# Altium schematic sheet Fri3d_2024_Exp0_Keyboard_01.SchDoc: Keyboard
size A3; Date: 18/06/2024; DrawnBy: Wim Van Gool; DocumentNumber: 2; Revision: 01; SheetNumber: 2; SheetTotal: 2
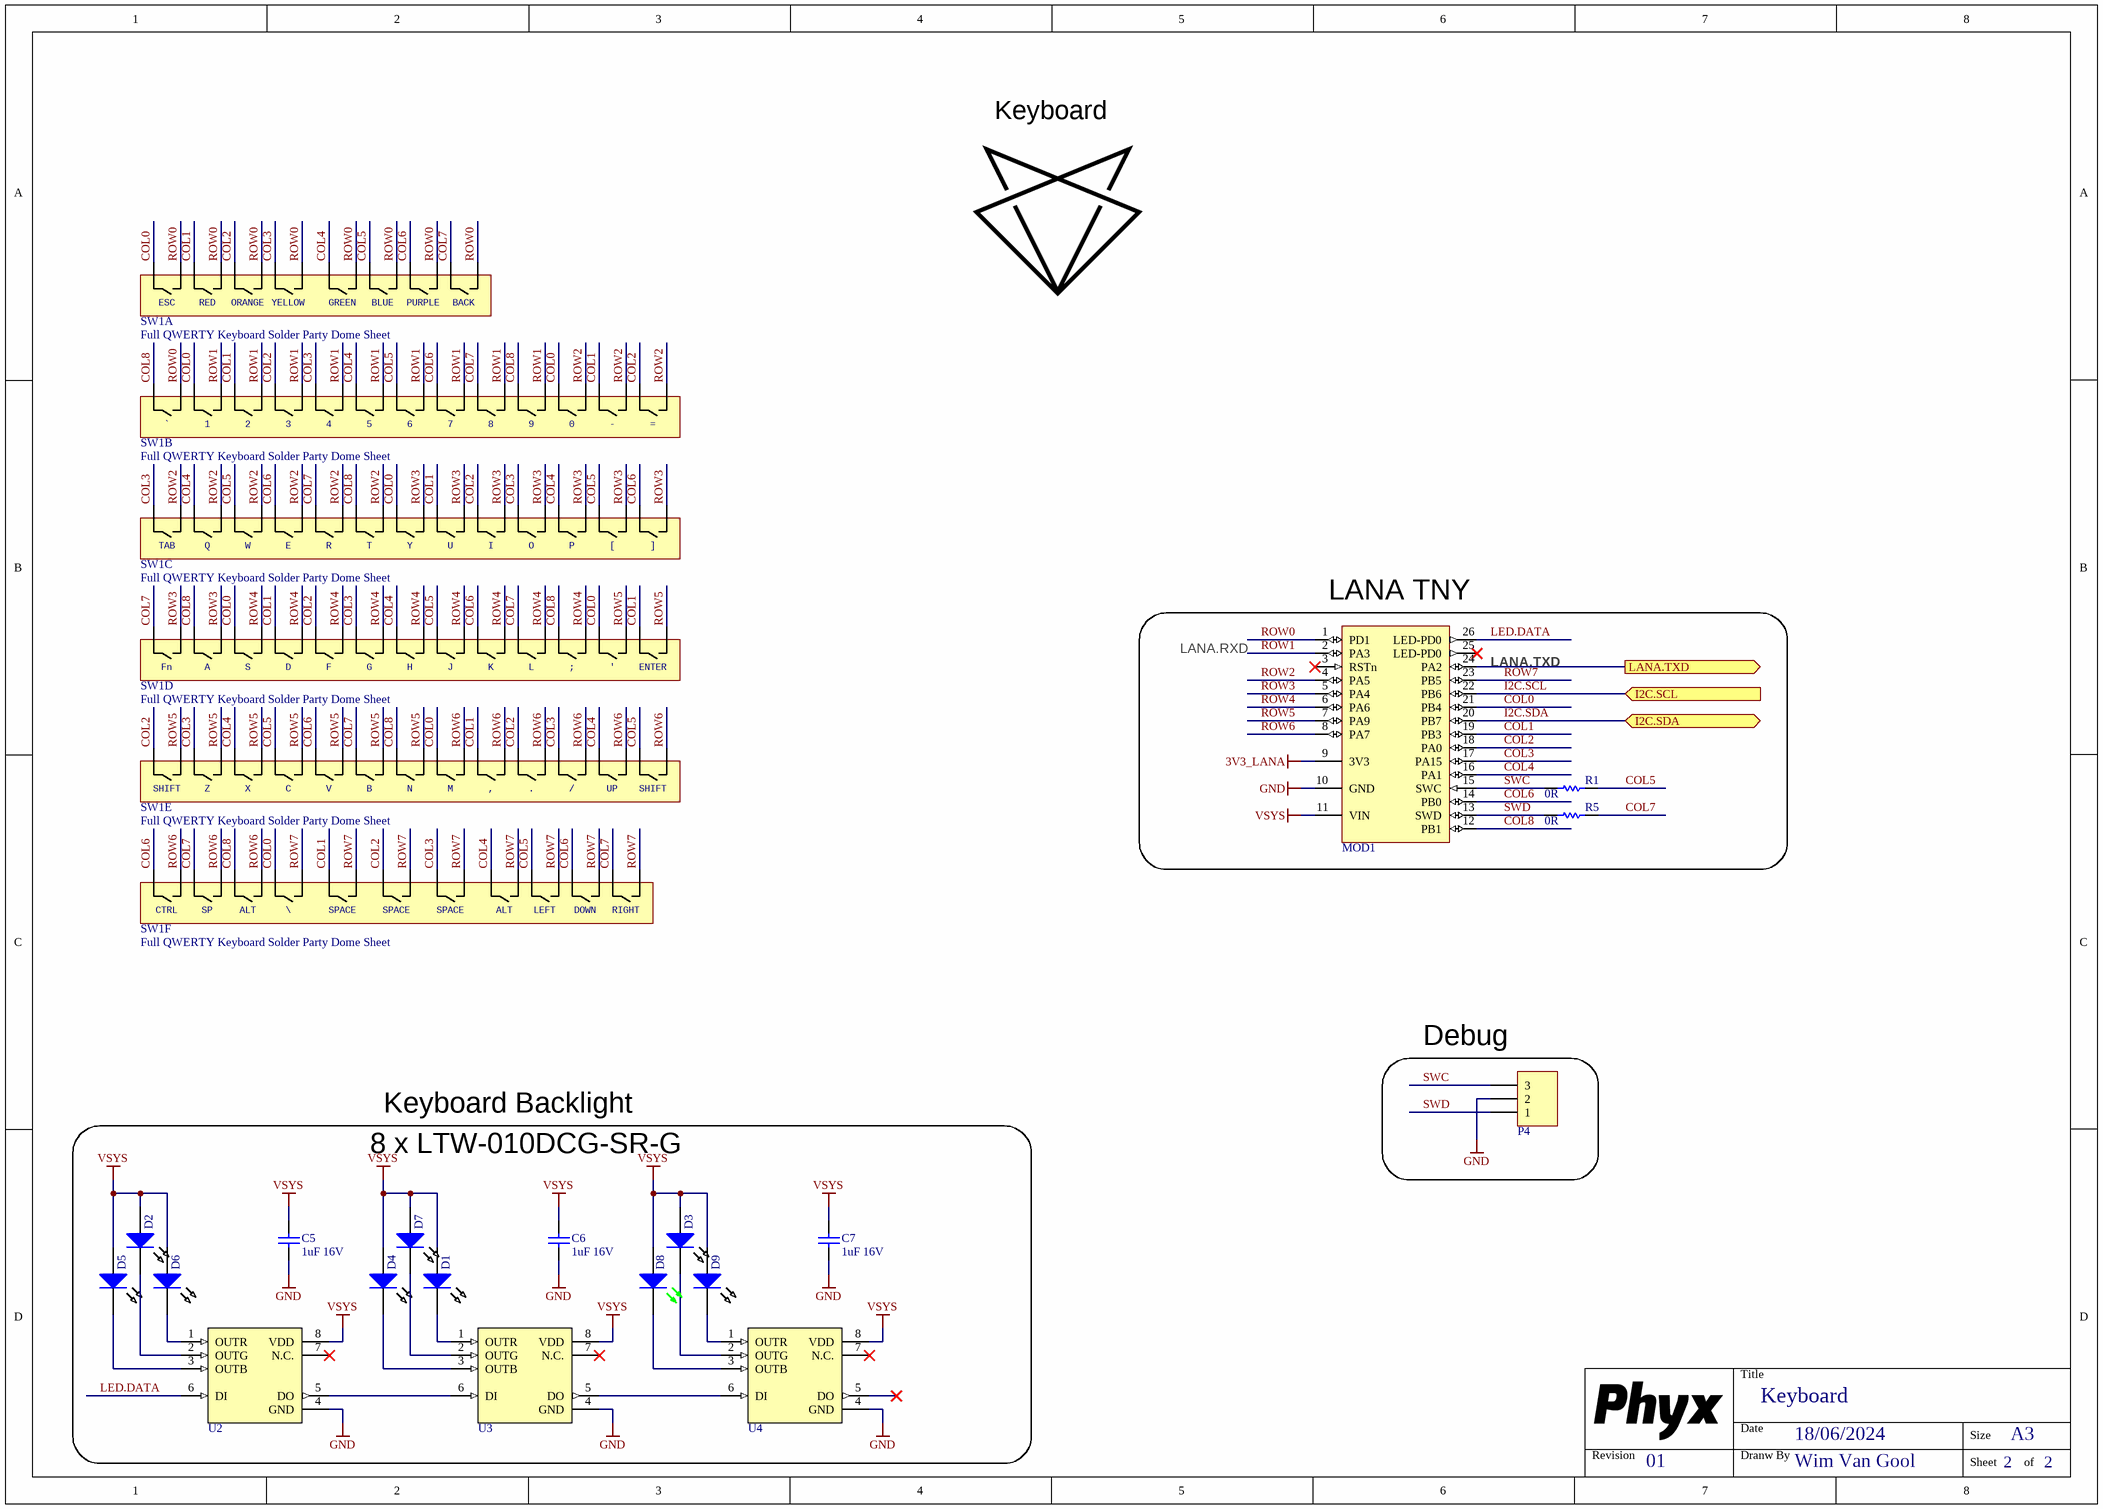
[diagram p0: Fri3d_2024_Exp0_Keyboard_01.SchDoc]

## Parts
C5  value 1uF 16V  [C0603_N]  (hidden comment: CAP_CERAMIC)
C6  value 1uF 16V  [C0603_N]  (hidden comment: CAP_CERAMIC)
C7  value 1uF 16V  [C0603_N]  (hidden comment: CAP_CERAMIC)
D1  Side emitting Cool White LED 3.0V 30mA 120° 2900mcd  [LITE_LTW-010DCG]  (value not drawn)
D2  Side emitting Cool White LED 3.0V 30mA 120° 2900mcd  [LITE_LTW-010DCG]  (value not drawn)
D3  Side emitting Cool White LED 3.0V 30mA 120° 2900mcd  [LITE_LTW-010DCG]  (value not drawn)
D4  Side emitting Cool White LED 3.0V 30mA 120° 2900mcd  [LITE_LTW-010DCG]  (value not drawn)
D5  Side emitting Cool White LED 3.0V 30mA 120° 2900mcd  [LITE_LTW-010DCG]  (value not drawn)
D6  Side emitting Cool White LED 3.0V 30mA 120° 2900mcd  [LITE_LTW-010DCG]  (value not drawn)
D7  Side emitting Cool White LED 3.0V 30mA 120° 2900mcd  [LITE_LTW-010DCG]  (value not drawn)
D8  Default 0805 Green LED  [LED_0805_GR]  (value not drawn)
D9  Side emitting Cool White LED 3.0V 30mA 120° 2900mcd  [LITE_LTW-010DCG]  (value not drawn)
MOD1  CH23V203 based TNY module  [PHYX_LANA_TNY_SMD]  (value not drawn)
P4  Header 3  [HDR1X3]  (value not drawn)
R1  value 0R  [R0603_N]  (hidden comment: RESISTOR)
R5  value 0R  [R0603_N]  (hidden comment: RESISTOR)
SW1  Full QWERTY Keyboard Solder Party Dome Sheet  [Solder_Party_Keyb]  (parts A,B,C,D,E,F of 6)
U2  3 Channel CC LED Driver 20mA  [WS_FSOP-8]  (value not drawn)
U3  3 Channel CC LED Driver 20mA  [WS_FSOP-8]  (value not drawn)
U4  3 Channel CC LED Driver 20mA  [WS_FSOP-8]  (value not drawn)

## Blocks framed on the sheet
8 x LTW-010DCG-SR-G: C5-C7 D1-D9 U2-U4

## Ports
I2C.SCL (in), I2C.SDA (bidir), LANA.TXD (out)

## Nets
3V3_LANA: MOD1.9(3V3)
GND: C5.2 C6.2 C7.2 MOD1.10(GND) P4.2 U2.4(GND) U3.4(GND) U4.4(GND)
VSYS: C5.1 C6.1 C7.1 D1.1(A) D2.1(A) D3.1(A) D4.1(A) D5.1(A) D6.1(A) D7.1(A) D8.1(A) D9.1(A) MOD1.11(VIN) U2.8(VDD) U3.8(VDD) U4.8(VDD)
COL0: MOD1.21(PB4) SW1.1 SW1.19 SW1.37 SW1.55 SW1.73 SW1.91 SW1.109 SW1.127
COL1: MOD1.19(PB3) SW1.3 SW1.21 SW1.39 SW1.57 SW1.75 SW1.93 SW1.111 SW1.129
COL2: MOD1.18(PA0) SW1.5 SW1.23 SW1.41 SW1.59 SW1.77 SW1.95 SW1.113 SW1.131
COL3: MOD1.17(PA15) SW1.7 SW1.25 SW1.43 SW1.61 SW1.79 SW1.97 SW1.115 SW1.133
COL4: MOD1.16(PA1) SW1.9 SW1.27 SW1.45 SW1.63 SW1.81 SW1.99 SW1.117 SW1.135
COL5: R1.1 SW1.11 SW1.29 SW1.47 SW1.65 SW1.83 SW1.101 SW1.119 SW1.137
COL6: MOD1.14(PB0) SW1.13 SW1.31 SW1.49 SW1.67 SW1.85 SW1.103 SW1.121 SW1.139
COL7: R5.1 SW1.15 SW1.33 SW1.51 SW1.69 SW1.87 SW1.105 SW1.123 SW1.141
COL8: MOD1.12(PB1) SW1.17 SW1.35 SW1.53 SW1.71 SW1.89 SW1.107 SW1.125
I2C.SCL: MOD1.22(PB6) ; port I2C.SCL
I2C.SDA: MOD1.20(PB7) ; port I2C.SDA
LANA.TXD: MOD1.24(PA2) ; port LANA.TXD
LED.DATA: MOD1.26(LED-PD0) U2.6(DI)
ROW0: MOD1.1(PD1) SW1.2 SW1.4 SW1.6 SW1.8 SW1.10 SW1.12 SW1.14 SW1.16 SW1.18
ROW1: MOD1.2(PA3) SW1.20 SW1.22 SW1.24 SW1.26 SW1.28 SW1.30 SW1.32 SW1.34 SW1.36
ROW2: MOD1.4(PA5) SW1.38 SW1.40 SW1.42 SW1.44 SW1.46 SW1.48 SW1.50 SW1.52 SW1.54
ROW3: MOD1.5(PA4) SW1.56 SW1.58 SW1.60 SW1.62 SW1.64 SW1.66 SW1.68 SW1.70 SW1.72
ROW4: MOD1.6(PA6) SW1.74 SW1.76 SW1.78 SW1.80 SW1.82 SW1.84 SW1.86 SW1.88 SW1.90
ROW5: MOD1.7(PA9) SW1.92 SW1.94 SW1.96 SW1.98 SW1.100 SW1.102 SW1.104 SW1.106 SW1.108
ROW6: MOD1.8(PA7) SW1.110 SW1.112 SW1.114 SW1.116 SW1.118 SW1.120 SW1.122 SW1.124 SW1.126
ROW7: MOD1.23(PB5) SW1.128 SW1.130 SW1.132 SW1.134 SW1.136 SW1.138 SW1.140 SW1.142
SWC: MOD1.15(SWC) P4.3 R1.2
SWD: MOD1.13(SWD) P4.1 R5.2
NetD1_2: D1.2(K) U3.1(OUTR)
NetD2_2: D2.2(K) U2.2(OUTG)
NetD3_2: D3.2(K) U4.2(OUTG)
NetD4_2: D4.2(K) U3.3(OUTB)
NetD5_2: D5.2(K) U2.3(OUTB)
NetD6_2: D6.2(K) U2.1(OUTR)
NetD7_2: D7.2(K) U3.2(OUTG)
NetD8_2: D8.2(K) U4.3(OUTB)
NetD9_2: D9.2(K) U4.1(OUTR)
NetU2_5: U2.5(DO) U3.6(DI)
NetU3_5: U3.5(DO) U4.6(DI)

Not connected (* = marked no-connect by the designer): MOD1 3(RSTn)* 25(LED-PD0)*; U2 7(N.C.)*; U3 7(N.C.)*; U4 5(DO)* 7(N.C.)*

## Notes on the sheet
- (near MOD1) LANA TNY
- LANA.RXD
- (near MOD1) LANA.TXD
- (near P4) Debug
- Keyboard Backlight
- Title
- Revision
- Date
- Dranw By
- Size
- A3
- Sheet
- of
- (in symbol Solder_Party_Keyb, part A) ESC; RED; ORANGE; YELLOW; GREEN; BLUE; PURPLE; BACK
- (in symbol Solder_Party_Keyb, part B) `; 0; -
- (in symbol Solder_Party_Keyb, part C) TAB; Q; W; E; R; T; Y; U; I; O; P; [; ]
- (in symbol Solder_Party_Keyb, part D) Fn; A; S; D; F; G; H; J; K; L; ;; '; ENTER
- (in symbol Solder_Party_Keyb, part E) SHIFT; Z; X; C; V; B; N; M; ,; .; /; UP
- (in symbol Solder_Party_Keyb, part F) CTRL; SP; ALT; \; SPACE; LEFT; DOWN; RIGHT

## Library data of the parts
C5-C7 = CAP # 1uF 16V 0603: Capacitor Ceramic; Supplier 1: Farnell; Supplier Part Number 1: 2320814; Supplier 2: LCSC; Supplier Part Number 2: C1592; Supplier 3: Generic; Supplier Part Number 3: 1uF 16V 0603 X7R
D1-D7 D9 = LED # White Side Emitting LTW-010DCG-SR-G: =Description; Value: LTW-010DCG-SR-G; Supplier 1: LCSC; Supplier Part Number 1: C5175311; Supplier 2: LCSC; Supplier Part Number 2: C5175309; Supplier 3: LCSC; Supplier Part Number 3: C5175310
D8 = LED # Green 0805: =Description; Supplier 1: Farnell; Supplier Part Number 1: 2099239; Supplier 2: LCSC; Supplier Part Number 2: C965815
MOD1 = MOD # CH23V203 LANA TNY SMD: Value: LANA TNY; Supplier 1: Phyx; Supplier Part Number 1: LANA TNY
P4 = Pin Header 2.54mm 3way: Supplier 1: LCSC; Supplier Part Number 1: C429954; Supplier 2: LCSC; Supplier Part Number 2: C49257
R1 R5 = RES # 0R 0603: Supplier 1: Farnell; Supplier Part Number 1: 2447743; Supplier 2: LCSC; Supplier Part Number 2: C95177; Supplier 3: Generic; Supplier Part Number 3: 0R 1% 0603
SW1 = Solder_Party_Keyb
U2-U4 = LED_DRVR # WS2811F FSOP-8: WS2811F 3-Ch LED Driver; Value: WS2811F; Supplier 1: LCSC; Supplier Part Number 1: C5446692